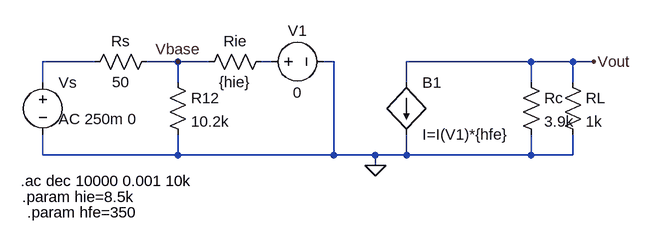
[diagram p0: schematic Modelo Hibrido.asc]
Modelo Hibrido.asc, the LTspice schematic file:
Version 4
SHEET 1 1000 680
WIRE 144 112 64 112
WIRE 272 112 224 112
WIRE 320 112 272 112
WIRE 416 112 400 112
WIRE 512 112 496 112
WIRE 816 112 624 112
WIRE 880 112 816 112
WIRE 912 112 880 112
WIRE 64 144 64 112
WIRE 272 144 272 112
WIRE 624 144 624 112
WIRE 816 144 816 112
WIRE 880 144 880 112
WIRE 64 256 64 224
WIRE 272 256 272 224
WIRE 272 256 64 256
WIRE 512 256 512 112
WIRE 512 256 272 256
WIRE 576 256 512 256
WIRE 624 256 624 224
WIRE 624 256 576 256
WIRE 816 256 816 224
WIRE 816 256 624 256
WIRE 880 256 880 224
WIRE 880 256 816 256
WIRE 576 272 576 256
FLAG 576 272 0
FLAG 272 112 Vbase
FLAG 912 112 Vout
SYMBOL voltage 64 128 R0
WINDOW 123 24 72 Left 2
WINDOW 39 0 0 Left 0
WINDOW 3 24 44 Left 2
SYMATTR Value2 AC 250m 0
SYMATTR InstName Vs
SYMATTR Value ""
SYMBOL res 240 96 R90
WINDOW 0 0 56 VBottom 2
WINDOW 3 32 56 VTop 2
SYMATTR InstName Rs
SYMATTR Value 50
SYMBOL res 256 128 R0
SYMATTR InstName R12
SYMATTR Value 10.2k
SYMBOL res 864 128 R0
SYMATTR InstName RL
SYMATTR Value 1k
SYMBOL res 416 96 R90
WINDOW 0 0 56 VBottom 2
WINDOW 3 32 56 VTop 2
SYMATTR InstName Rie
SYMATTR Value {hie}
SYMBOL voltage 400 112 R270
WINDOW 0 32 56 VTop 2
WINDOW 3 -32 56 VBottom 2
SYMATTR InstName V1
SYMATTR Value 0
SYMBOL res 800 128 R0
SYMATTR InstName Rc
SYMATTR Value 3.9k
SYMBOL bi 624 144 R0
SYMATTR InstName B1
SYMATTR Value I=I(V1)*{hfe}
TEXT 30 296 Left 2 !.ac dec 10000 0.001 10k
TEXT 32 320 Left 2 !.param hie=8.5k
TEXT 40 344 Left 2 !.param hfe=350

The netlist it stands for:
* Modelo Hibrido.asc
Vs N001 0 AC 250m 0
Rs Vbase N001 50
R12 Vbase 0 10.2k
RL Vout 0 1k
Rie N002 Vbase {hie}
V1 N002 0 0
Rc Vout 0 3.9k
B1 Vout 0 I=I(V1)*{hfe}
.ac dec 10000 0.001 10k
.param hie=8.5k
.param hfe=350
.backanno
.end